# EAGLE design PWM_1_1 (EAGLE 7.6.0)
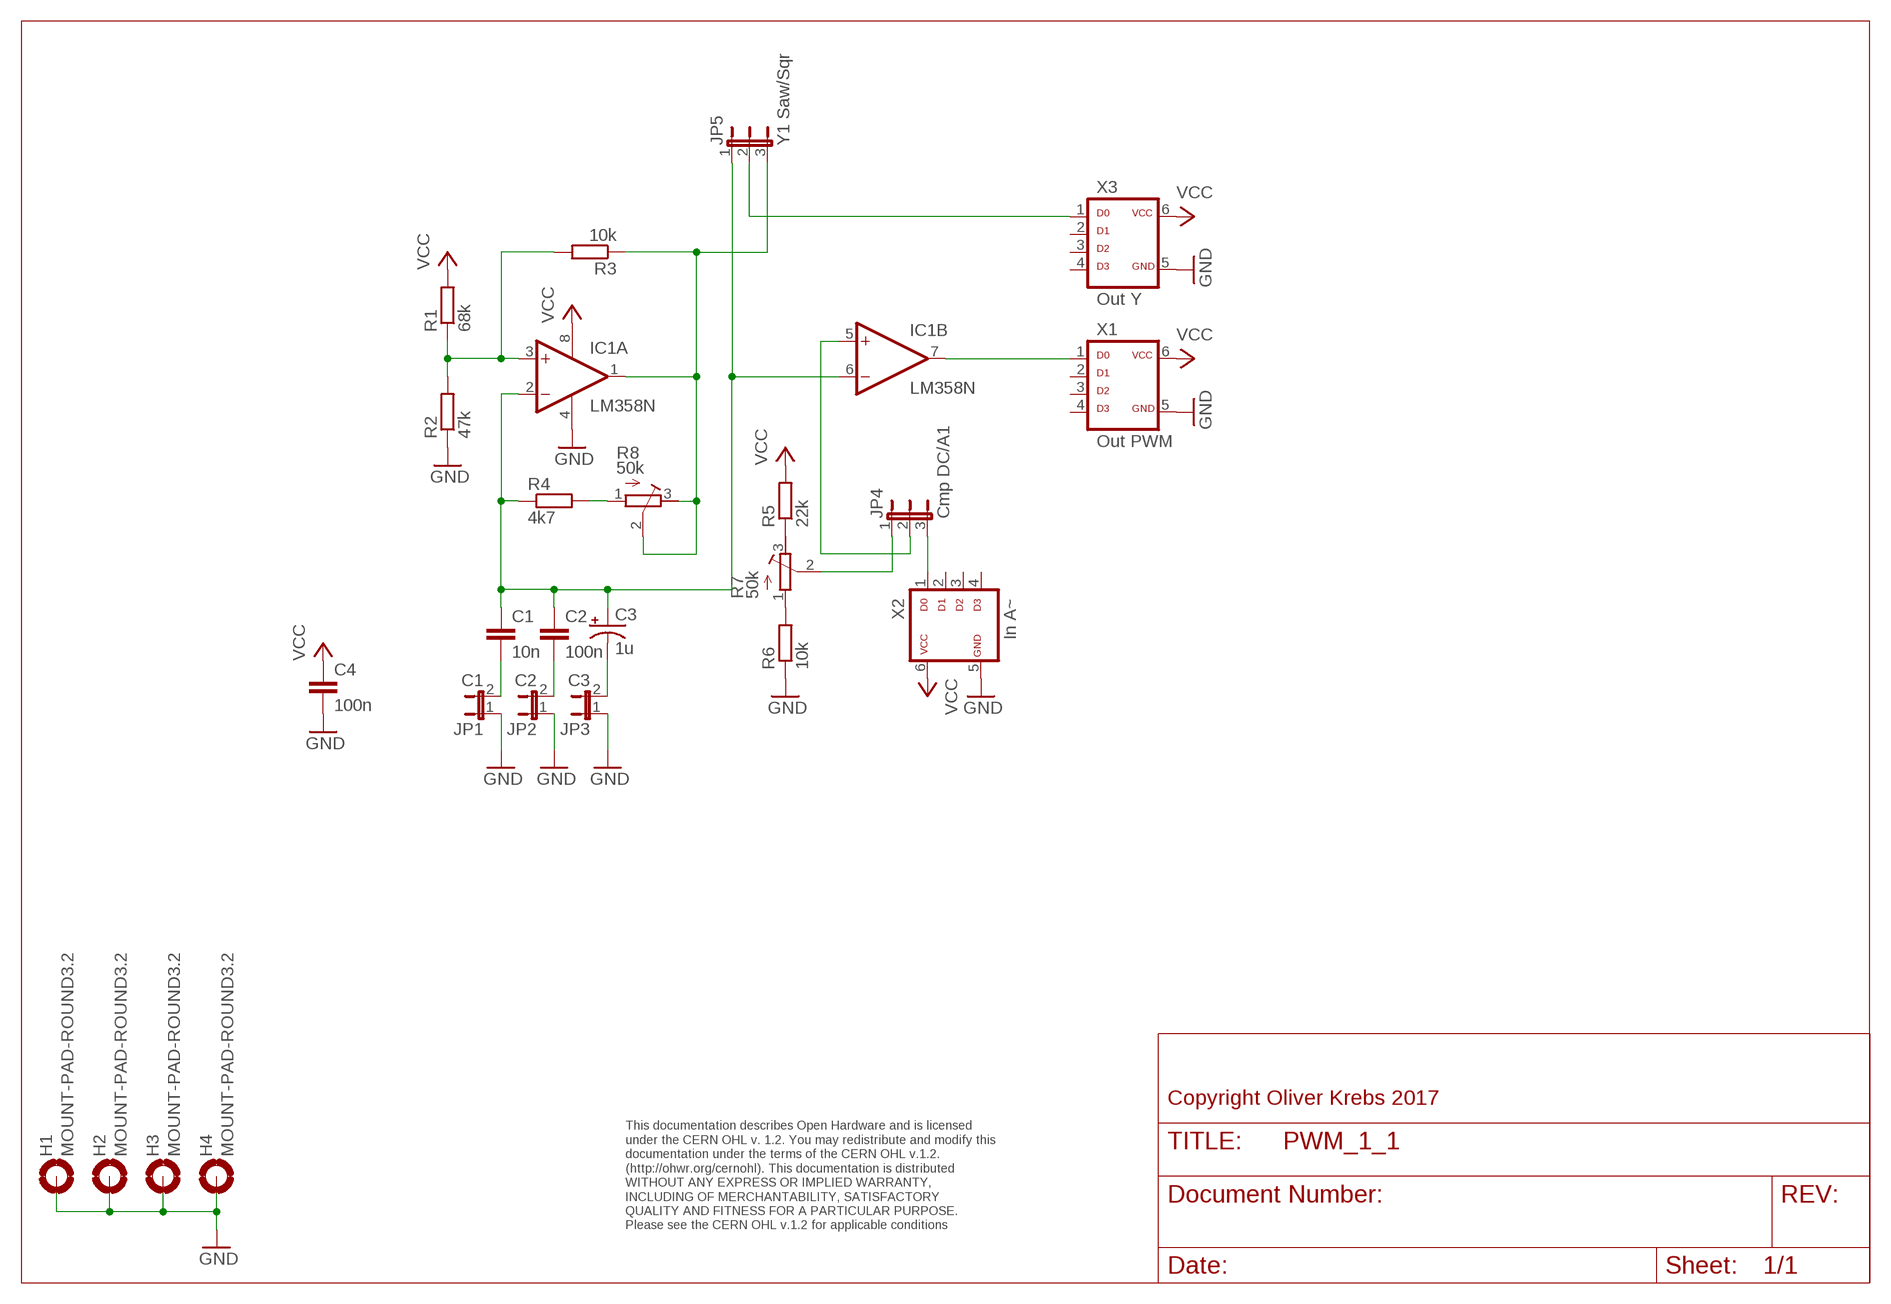
[diagram p0: schematic, sheet 1]

## Parts
C1  10n  C-EU050-025X075  [C050-025X075]
C2  100n  C-EU050-025X075  [C050-025X075]
C3  1u  CAP_POLPTH2  [CPOL-RADIAL-10UF-25V]
C4  100n  C-EU050-025X075  [C050-025X075]
H1  MOUNT-PAD-ROUND3.2  [3,2-PAD]
H2  MOUNT-PAD-ROUND3.2  [3,2-PAD]
H3  MOUNT-PAD-ROUND3.2  [3,2-PAD]
H4  MOUNT-PAD-ROUND3.2  [3,2-PAD]
IC1  LM358N  [DIL08]
JP1  C1  JP1E  [JP1]
JP2  C2  JP1E  [JP1]
JP3  C3  JP1E  [JP1]
JP4  Cmp DC/A1  JP2EJP2-U  [JP2-U]
JP5  Y1 Saw/Sqr  JP2EJP2-U  [JP2-U]
R1  68k  R-EU_0207/10  [0207/10]
R2  47k  R-EU_0207/10  [0207/10]
R3  10k  R-EU_0207/10  [0207/10]
R4  4k7  R-EU_0207/10  [0207/10]
R5  22k  R-EU_0207/10  [0207/10]
R6  10k  R-EU_0207/10  [0207/10]
R7  50k  R-TRIMMACP  [ACP-6L]
R8  50k  R-TRIMMACP  [ACP-6L]
X1  Out PWM  ML6D  [ML-6]
X2  In A~  ML6D  [ML-6]
X3  Out Y  ML6D  [ML-6]

## Nets
GND: C4.2 H1.B3,2(MOUNT) H2.B3,2(MOUNT) H3.B3,2(MOUNT) H4.B3,2(MOUNT) IC1.4(P:V-) JP1.1 JP2.1 JP3.1 R2.1 R6.1 X1.5 X2.5 X3.5
N$1: IC1.3(A:+IN) R1.1 R2.2 R3.2
N$2: IC1.1(A:OUT) JP5.3 R3.1 R8.2(S) R8.3(E)
N$3: R4.2 R8.1(A)
N$4: C2.2 JP2.2
N$5: C1.2 JP1.2
N$6: C1.1 C2.1 C3.1(+) IC1.2(A:-IN) IC1.6(B:-IN) JP5.1 R4.1
N$7: C3.2(-) JP3.2
N$9: IC1.5(B:+IN) JP4.2
N$10: JP4.1 R7.2(S)
N$11: R5.1 R7.3(E)
N$12: R6.2 R7.1(A)
N$13: JP4.3 X2.1
N$14: IC1.7(B:OUT) X1.1
N$15: JP5.2 X3.1
VCC: C4.1 IC1.8(P:V+) R1.2 R5.2 X1.6 X2.6 X3.6
Unconnected: X1.2 X1.3 X1.4 X2.2 X2.3 X2.4 X3.2 X3.3 X3.4

## Notes on the sheet
- Copyright Oliver Krebs 2017
- This documentation describes Open Hardware and is licensed 
  under the CERN OHL v. 1.2. You may redistribute and modify this 
  documentation under the terms of the CERN OHL v.1.2. 
  (http://ohwr.org/cernohl). This documentation is distributed
  WITHOUT ANY EXPRESS OR IMPLIED WARRANTY, 
  INCLUDING OF MERCHANTABILITY, SATISFACTORY 
  QUALITY AND FITNESS FOR A PARTICULAR PURPOSE. 
  Please see the CERN OHL v.1.2 for applicable conditions

## Library data of the parts
C1 C2 C4 = 01-my_rcl:C-EU: CAPACITOR, European symbol
C3 = SparkFun-Capacitors:CAP_POL: Capacitor Polarized These are standard SMD and PTH capacitors. Normally 10uF, 47uF, and 100uF in electrolytic and tantalum varieties. Always verify the external diameter of the through hole cap, it varies with capacity, voltage, and manufacturer. The EIA devices should be standard.
H1-H4 = holes:MOUNT-PAD-ROUND: MOUNTING PAD, round
IC1 = 01-my-linear:LM358: OP AMP also LM158; LM258; LM2904 Source: http://cache.national.com/ds/LM/LM158.pdf
JP1-JP3 = 01-my-jumper:JP1E: JUMPER
JP4 JP5 = 01-my-jumper:JP2E: JUMPER
R1-R6 = 01-my_rcl:R-EU_: RESISTOR, European symbol
R7 R8 = 01-my_rcl:R-TRIMM: Trimm resistor
X1-X3 = 01-my-con:ML6D

## Board
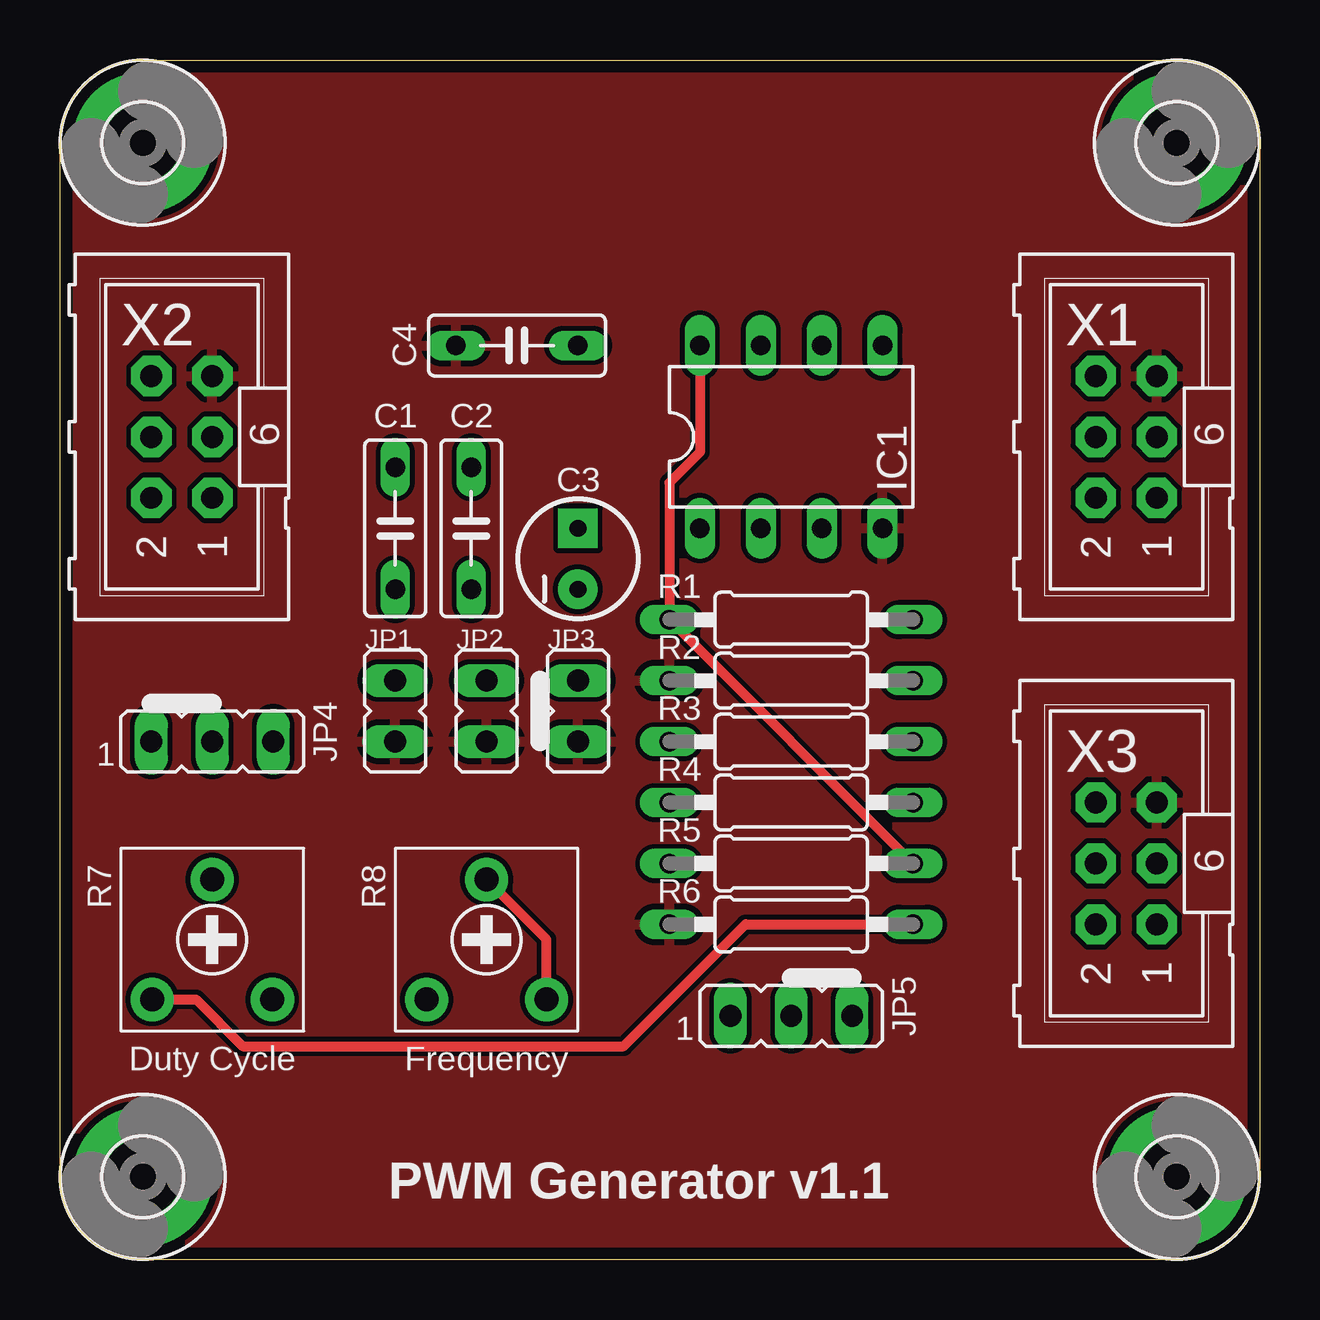
[diagram p1: board, top side]
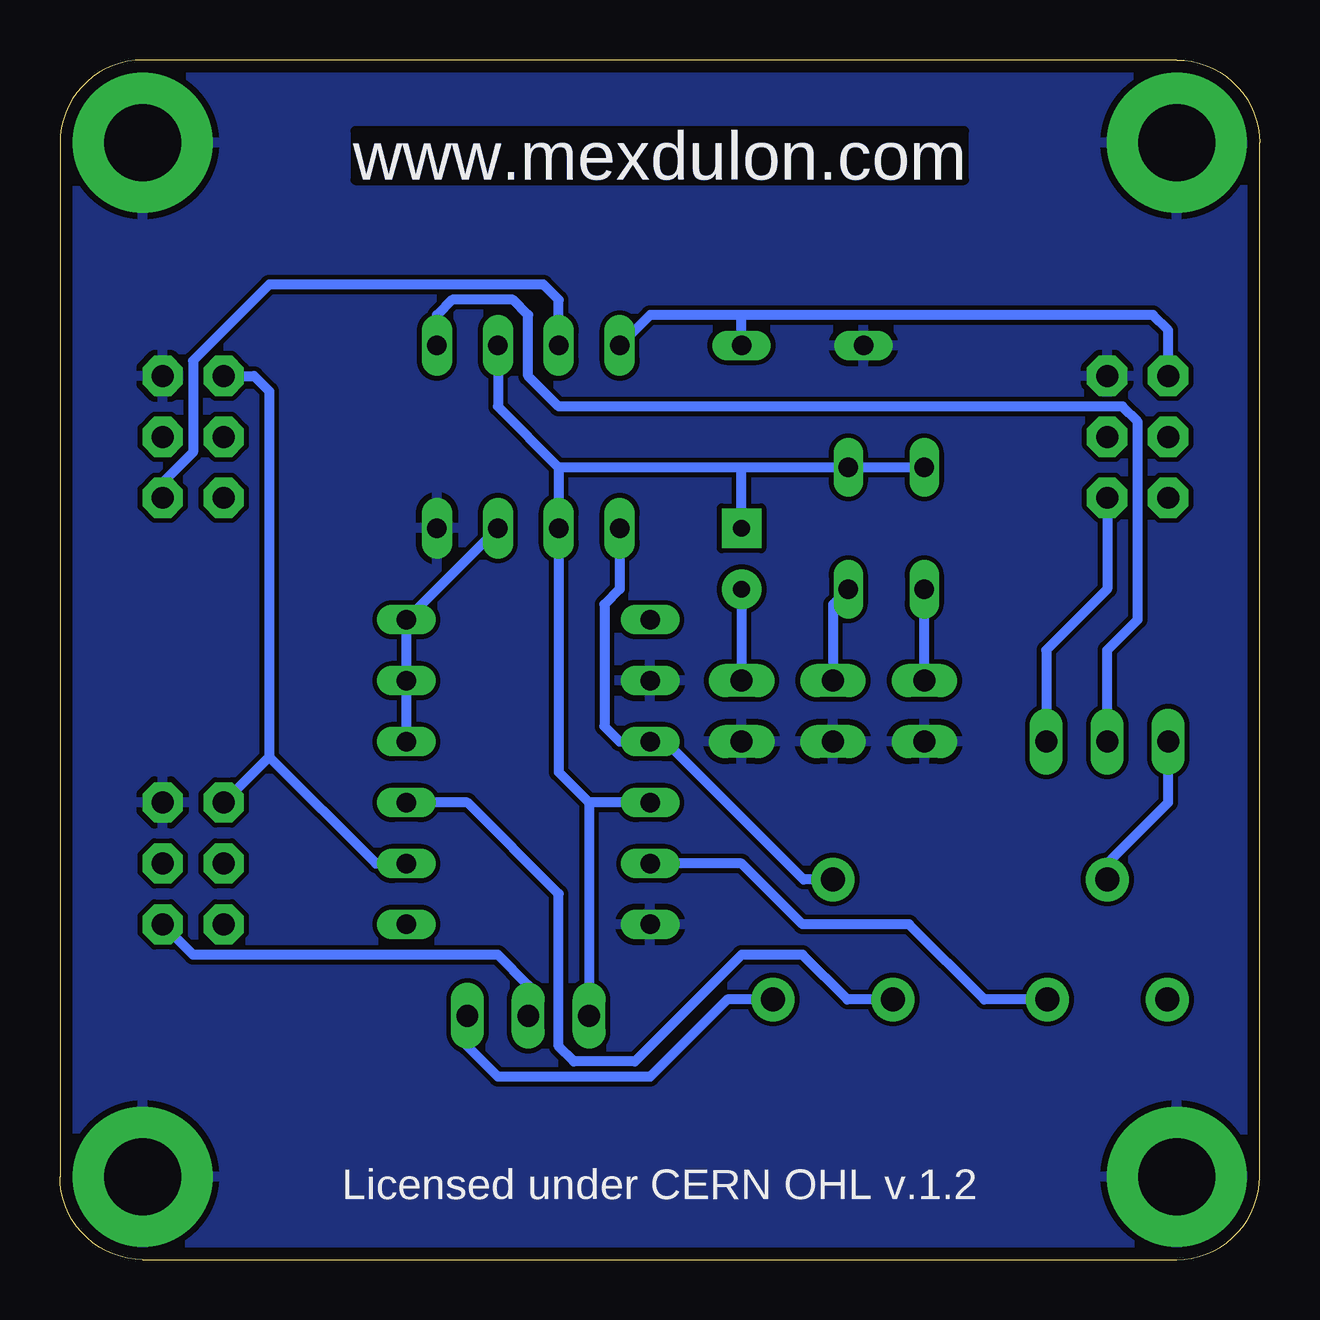
[diagram p2: board, bottom side, seen from below]

Size 50 x 50 mm. Coordinates in mm from the lower left corner, seen from the top.
Outline: 0,3.45 0,46.55 arc-90 3.45,50 46.55,50 arc-90 50,46.55 50,3.45 arc-90 46.55,0 3.45,0 arc-90 0,3.45
Copper layers (1*16): Top 0.035mm / dielectric 1.6mm / Bottom 0.035mm
Design rules "Elecrow_2-layer_PCB_eagle_rule": minimum track width 6mil, minimum drill 12mil, track to track 6mil, track to pad 6mil, pad to pad 6mil, via to via 8mil, smd to smd 0mil, copper to edge 20mil, drill to drill 10mil, minimum pad ring 6mil, minimum via ring 6mil, stop-mask expansion 0mil, vias tented up to drill 100mil, thermal gap 10mil

### Footprints (pad centres in the part's own frame; a part is rotated, then mirrored left to right if it is on the bottom)
C050-025X075 = drill 0.813 long: 1 -2.54,0; 2 2.54,0
CPOL-RADIAL-10UF-25V = drill 0.7 pad 1.651 square: 1 1.27,0 | drill 0.7 pad 1.651: 2 -1.27,0
3,2-PAD = drill 3.2 pad 5.842: B3,2 0,0
DIL08 = drill 0.813 pad 1.27 long: 1 -3.81,-3.81; 2 -1.27,-3.81; 3 1.27,-3.81; 4 3.81,-3.81; 5 3.81,3.81; 6 1.27,3.81; 7 -1.27,3.81; 8 -3.81,3.81
JP1 = drill 0.914 long: 1 0,-1.27; 2 0,1.27
JP2-U = drill 0.914 long: 1 -2.54,0; 2 0,0; 3 2.54,0
0207/10 = drill 0.813 long: 1 -5.08,0; 2 5.08,0
ACP-6L = drill 1 pad 1.8: 1 -2.5,-2.5; 2 0,2.5; 3 2.5,-2.5
ML-6 = drill 0.914 pad 1.676 octagon: 1 -2.54,-1.27; 2 -2.54,1.27; 3 0,-1.27; 4 0,1.27; 5 2.54,-1.27; 6 2.54,1.27

### Placement (x,y rotation side)
C1  13.97,30.48 270 top
C2  17.14,30.48 270 top
C3  21.59,29.21 90 top
C4  19.05,38.1 180 top
H1  3.45,3.45 0 top
H2  3.45,46.55 0 top
H3  46.55,46.55 0 top
H4  46.55,3.45 0 top
IC1  30.48,34.29 0 top
JP1  13.97,22.86 0 top
JP2  17.78,22.86 0 top
JP3  21.59,22.86 0 top
JP4  6.35,21.59 0 top
JP5  30.48,10.16 0 top
R1  30.48,26.67 180 top
R2  30.48,24.13 0 top
R3  30.48,21.59 0 top
R4  30.48,19.05 0 top
R5  30.48,16.51 0 top
R6  30.48,13.97 0 top
R7  6.35,13.34 0 top
R8  17.78,13.34 0 top
X1  44.45,34.29 90 top
X2  5.08,34.29 90 top
X3  44.45,16.51 90 top

### Tracks (layer width: path | path; a pad name or v marks a point on that pad's centre or on a via)
GND
  pour Bottom (isolate 0.203): 0,50.16 50.8,50.16 50.8,0 0,0
  pour Top (isolate 0.203): 0,50.16 50.8,50.16 50.8,0 0,0
N$1
  Bottom 0.406: R3.2 R2.2 R1.1 IC1.3
N$2
  Top 0.406: R8.3 20.28,13.34 R8.2
  Bottom 0.406: IC1.1 26.67,27.94 27.3,27.3 27.3,22.23 26.67,21.59 R3.1 24.77,21.59 19.01,15.84 R8.2 | R8.3 22.18,10.84 25.4,7.62 31.75,7.62 33.02,8.89 JP5.3
N$3
  Bottom 0.406: R8.1 17.18,10.84 19.05,12.7 21.59,12.7 26.04,8.26 28.57,8.26 29.21,8.89 29.21,15.24 33.02,19.05 R4.2
N$4
  Bottom 0.406: C2.2 17.78,27.3 JP2.2
N$5
  Bottom 0.406: JP1.2 C1.2
N$6
  Bottom 0.406: C1.1 C2.1 21.59,33.02 | 29.21,33.02 IC1.2 29.21,20.32 27.94,19.05 | IC1.6 31.75,35.56 29.21,33.02 | R4.1 27.94,19.05 | 27.94,19.05 JP5.1 | 21.59,33.02 29.21,33.02 | C3.1 21.59,33.02
N$7
  Bottom 0.406: C3.2 JP3.2
N$9
  Bottom 0.406: JP4.2 6.35,25.4 5.08,26.67 5.08,34.92 5.71,35.56 29.21,35.56 30.48,36.83 30.48,39.37 31.11,40.01 33.66,40.01 34.29,39.37 IC1.5
N$10
  Bottom 0.406: R7.2 6.35,16.51 3.81,19.05 JP4.1
N$11
  Bottom 0.406: R7.3 11.47,10.84 14.61,13.97 19.05,13.97 21.59,16.51 R5.1
N$12
  Top 0.406: R7.1 5.67,10.84 7.62,8.89 23.5,8.89 28.57,13.97 R6.2
N$13
  Bottom 0.406: X2.1 6.35,27.94 8.89,25.4 JP4.3
N$14
  Bottom 0.406: IC1.7 29.21,40.01 29.84,40.64 41.27,40.64 44.45,37.47 44.45,33.66 45.72,32.38 X1.1
N$15
  Bottom 0.406: JP5.2 30.48,11.43 31.75,12.7 44.45,12.7 X3.1
VCC
  Top 0.406: IC1.8 26.67,33.66 25.4,32.38 R1.2 R5.2
  Bottom 0.406: X2.6 3.81,38.73 4.45,39.37 21.59,39.37 | 21.59,39.37 25.4,39.37 IC1.8 | C4.1 21.59,39.37 | X1.6 41.91,36.83 41.27,36.2 41.27,20.95 | 41.27,20.95 X3.6 | R5.2 36.83,16.51 41.27,20.95

### Text on the board
Bottom: www.mexdulon.com
tNames: Duty Cycle | Frequency | PWM Generator v1.1
bNames: www.mexdulon.com | Licensed under CERN OHL v.1.2
200bmp: E:/Bilder/Elektronik/Modulion/Mexdulon/mexdulon_50x50_pcb.bmp